# Altium schematic sheet TYPE-C MALE 16PIN C399939.schdoc
size 124 x 99 mm
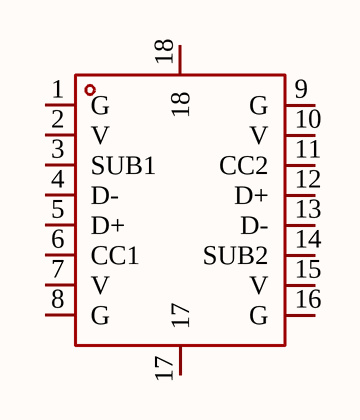
[diagram p0: TYPE-C MALE 16PIN C399939.schdoc]

## Parts
USB?  918-118A2021Y40002  [TYPE-C-SMD_JINGTUOJIN_918-118A2021Y40002]  (value not drawn)

## Nets

Not connected (* = marked no-connect by the designer): USB? 1(G) 2(V) 3(SUB1) 4(D-) 5(D+) 6(CC1) 7(V) 8(G) 9(G) 10(V) 11(CC2) 12(D+) 13(D-) 14(SUB2) 15(V) 16(G) 17 18

## Library data of the parts
USB? = 918-118A2021Y40002: Manufacturer: 精拓金; Add into BOM: yes; Connector Type: Type-C; Gender: 公; Number of Contacts: 16P; Number of Ports: 1; Symbol: 918-118A2021Y40002; Device: 918-118A2021Y40002; LCSC Part Name: Type-C 公 立贴; Supplier Part: C399939; Manufacturer Part: 918-118A2021Y40002; Supplier Footprint: SMD; JLCPCB Part Class: Extended Part; Datasheet: https://atta.szlcsc.com/upload/public/pdf/source/20230504/B126D31BD540D122A8150C41D071C7E6.pdf; Supplier: LCSC; Convert to PCB: yes; Standard: USB 2.0; Mounting Style: 立贴; Current Rating - Power (Max): -; Contact Material: -; Contact Plating: -; Operating Temperature Range: -; Soldering Temperature(Max): -; Rated Voltage (Max): -; Center Height: -; Length: -; Supplementary Features: -; Connect-Disconnect Life: -; Core Colour: -